# EAGLE schematic xmega16_tqfp (EAGLE 6.3)
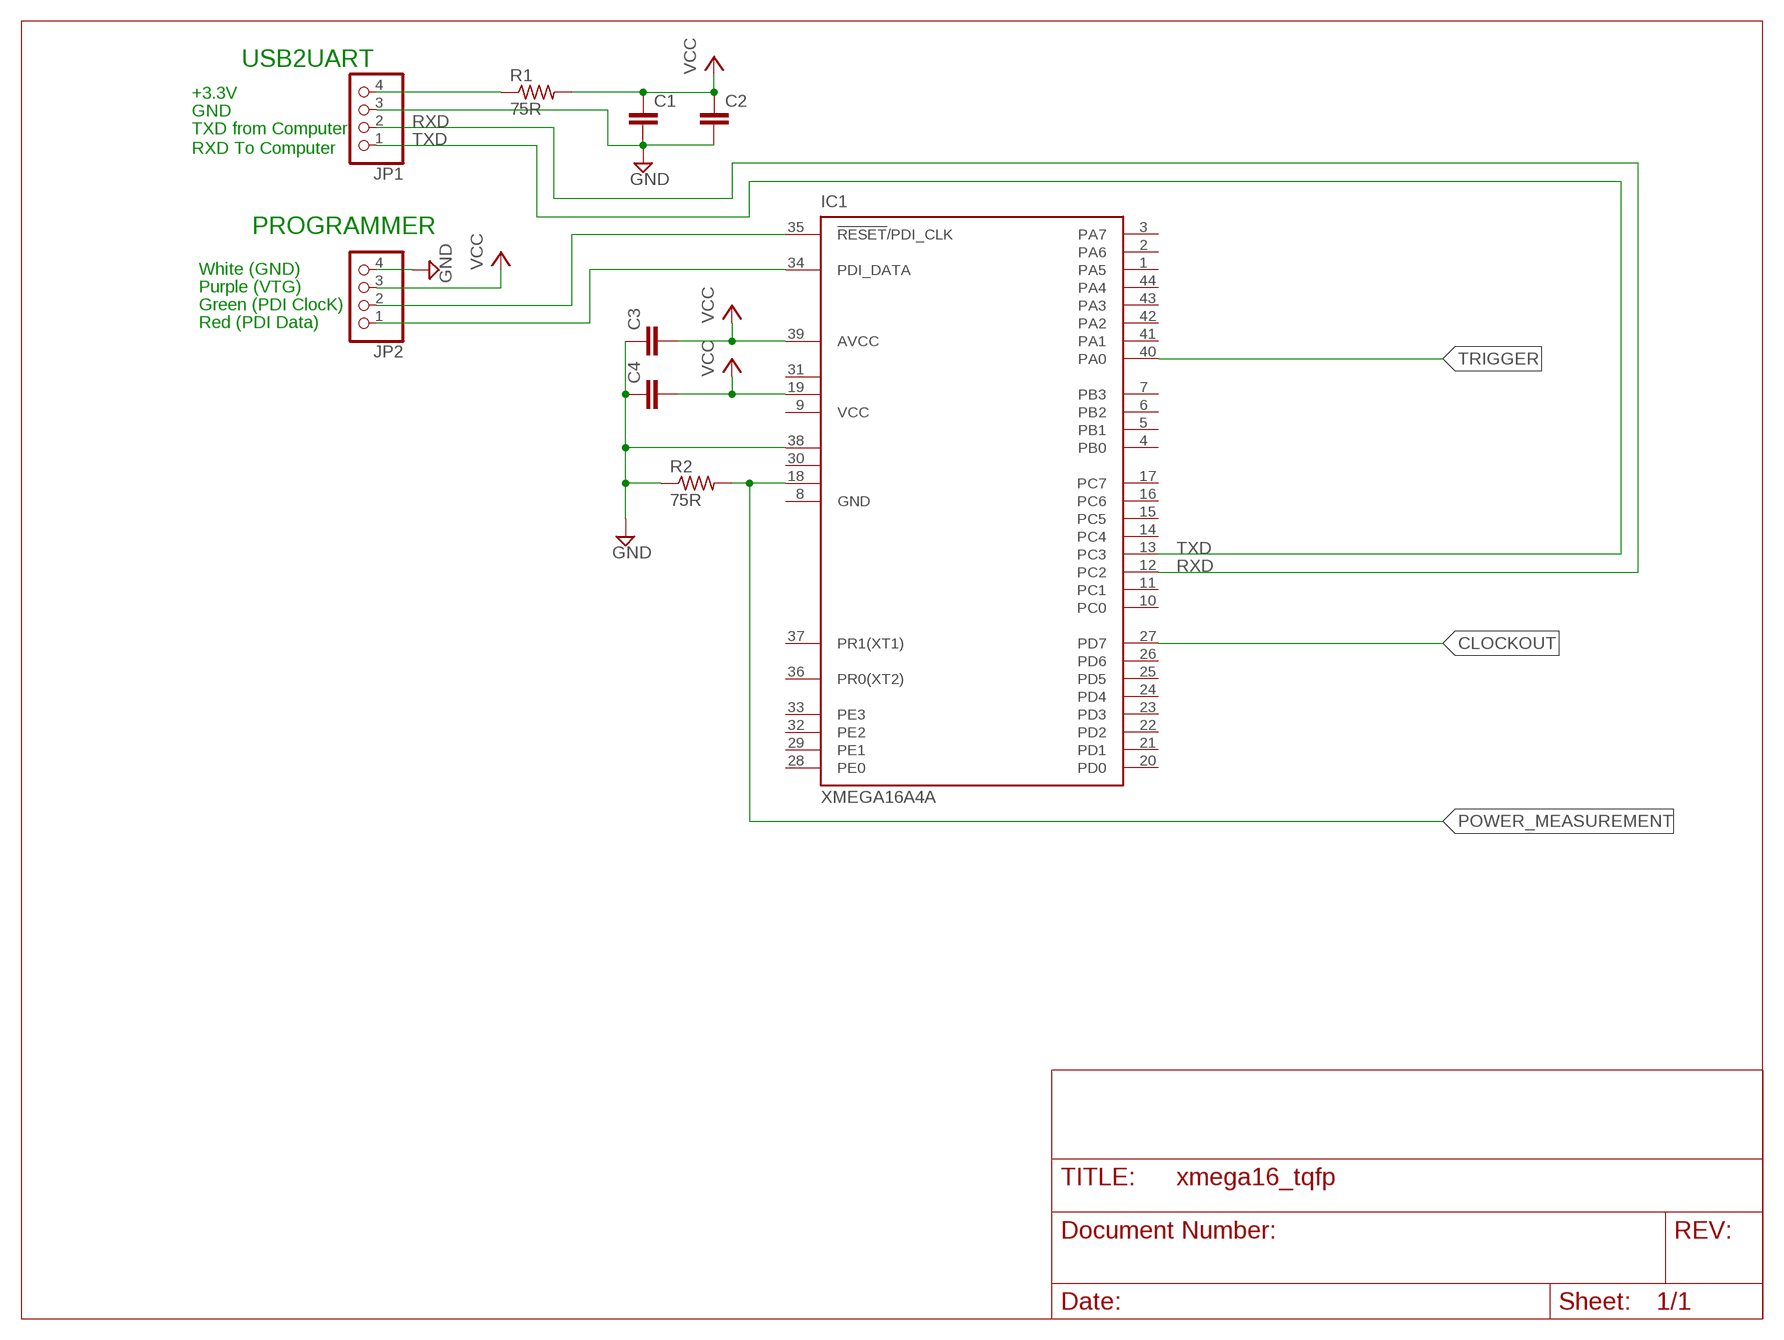
[diagram p0: schematic, sheet 1]

## Parts
C1  C-EUC0805  [C0805]
C2  C-EUC0805  [C0805]
C3  C-EUC0805  [C0805]
C4  C-EUC0805  [C0805]
IC1  XMEGA16A4A  [TQFP44]
JP1  PINHD-1X4/90  [1X04/90]
JP2  PINHD-1X4/90  [1X04/90]
R1  75R  R-US_R0805  [R0805]
R2  75R  R-US_R0805  [R0805]

## Nets
CLOCKOUT: IC1.27(PD7)
GND: C1.2 C2.2 C3.1 C4.1 IC1.38(GND3) JP1.3 JP2.4 R2.1
N$1: IC1.34(PDI_DATA) JP2.1
N$2: JP1.4 R1.1
N$3: IC1.35(!RESET!/PDI_CLK) JP2.2
POWER_MEASUREMENT: IC1.18(GND1) R2.2
RXD: IC1.12(PC2) JP1.2
TRIGGER: IC1.40(PA0)
TXD: IC1.13(PC3) JP1.1
VCC: C1.1 C2.1 C3.2 C4.2 IC1.19(VCC1) IC1.39(AVCC) JP2.3 R1.2
Unconnected: IC1.1(PA5) IC1.2(PA6) IC1.3(PA7) IC1.4(PB0) IC1.5(PB1) IC1.6(PB2) IC1.7(PB3) IC1.10(PC0) IC1.11(PC1) IC1.14(PC4) IC1.15(PC5) IC1.16(PC6) IC1.17(PC7) IC1.20(PD0) IC1.21(PD1) IC1.22(PD2) IC1.23(PD3) IC1.24(PD4) IC1.25(PD5) IC1.26(PD6) IC1.28(PE0) IC1.29(PE1) IC1.32(PE2) IC1.33(PE3) IC1.36(PR0(XT2)) IC1.37(PR1(XT1)) IC1.41(PA1) IC1.42(PA2) IC1.43(PA3) IC1.44(PA4)

## Notes on the sheet
- USB2UART
- +3.3V
- GND
- TXD from Computer
- RXD To Computer
- PROGRAMMER
- White (GND)
- Purple (VTG)
- Green (PDI ClocK)
- Red (PDI Data)

## Power pins joined to a net without a drawn wire
GND: IC1.8(GND)
GND2: IC1.30(GND2)
VCC: IC1.9(VCC)
VCC2: IC1.31(VCC2)

## Library data of the parts
C1-C4 = rcl:C-EU: CAPACITOR, European symbol
IC1 = atmel:XMEGA16A4: MICROCONTROLLER Features High-performance, Low-power 8/16-bit AVR XMEGA Microcontroller Non-Volatile Program and Data Memories - 16 KB - 128 KB of In-System Self-Programmable Flash - 4 KB - 8 KB Boot Code Section with Independent Lock Bits - 1 KB - 2 KB EEPROM - 2 KB - 8 KB Internal SRAM Peripheral Features - Four-channel DMA Controller with support for external requests - Eight-channel Event System - Five 16-bit Timer/Counters Three Timer/Counters with 4 Output Compare or Input Capture channels Two Timer/Counters with 2 Output Compare or Input Capture channels High-Resolution Extensions on all Timer/Counters Advanced Waveform Extension on one Timer/Counter - Five USARTs IrDA Extension on one USART - Two Two-Wire Interfaces with dual address match (I2C and SMBus compatible) - Two SPIs (Serial Peripheral Interfaces) peripherals - AES and DES Crypto Engine - 16-bit Real Time Counter with Separate Oscillator - One Twelve-channel, 12-bit, 2 Msps Analog to Digital Converter - One Two-channel, 12-bit, 1 Msps Digital to Analog Converter - Two Analog Comparators with Window compare function - External Interrupts on all General Purpose I/O pins - Programmable Watchdog Timer with Separate On-chip Ultra Low Power Oscillator Special Microcontroller Features - Power-on Reset and Programmable Brown-out Detection - Internal and External Clock Options with PLL - Programmable Multi-level Interrupt Controller - Sleep Modes: Idle, Power-down, Standby, Power-save, Extended Standby - Advanced Programming, Test and Debugging Interfaces PDI (Program and Debug Interface) for programming, test and debugging I/O and Packages - 34 Programmable I/O Lines - 44 - lead TQFP - 44 - pad VQFN/QFN - 49 - ball VFBGA Operating Voltage - 1.6 - 3.6V Speed performance - 0 - 12 MHz @ 1.6 - 3.6V - 0 - 32 MHz @ 2.7 - 3.6V Drawn by Dipl.-Ing. (FH) Robert Siegler Created: 27.05.09; OC_FARNELL: unknown; OC_NEWARK: unknown
JP1 JP2 = pinhead:PINHD-1X4: PIN HEADER
R1 R2 = rcl:R-US_: RESISTOR, American symbol